# EAGLE design memory_decoder (EAGLE 5.11)
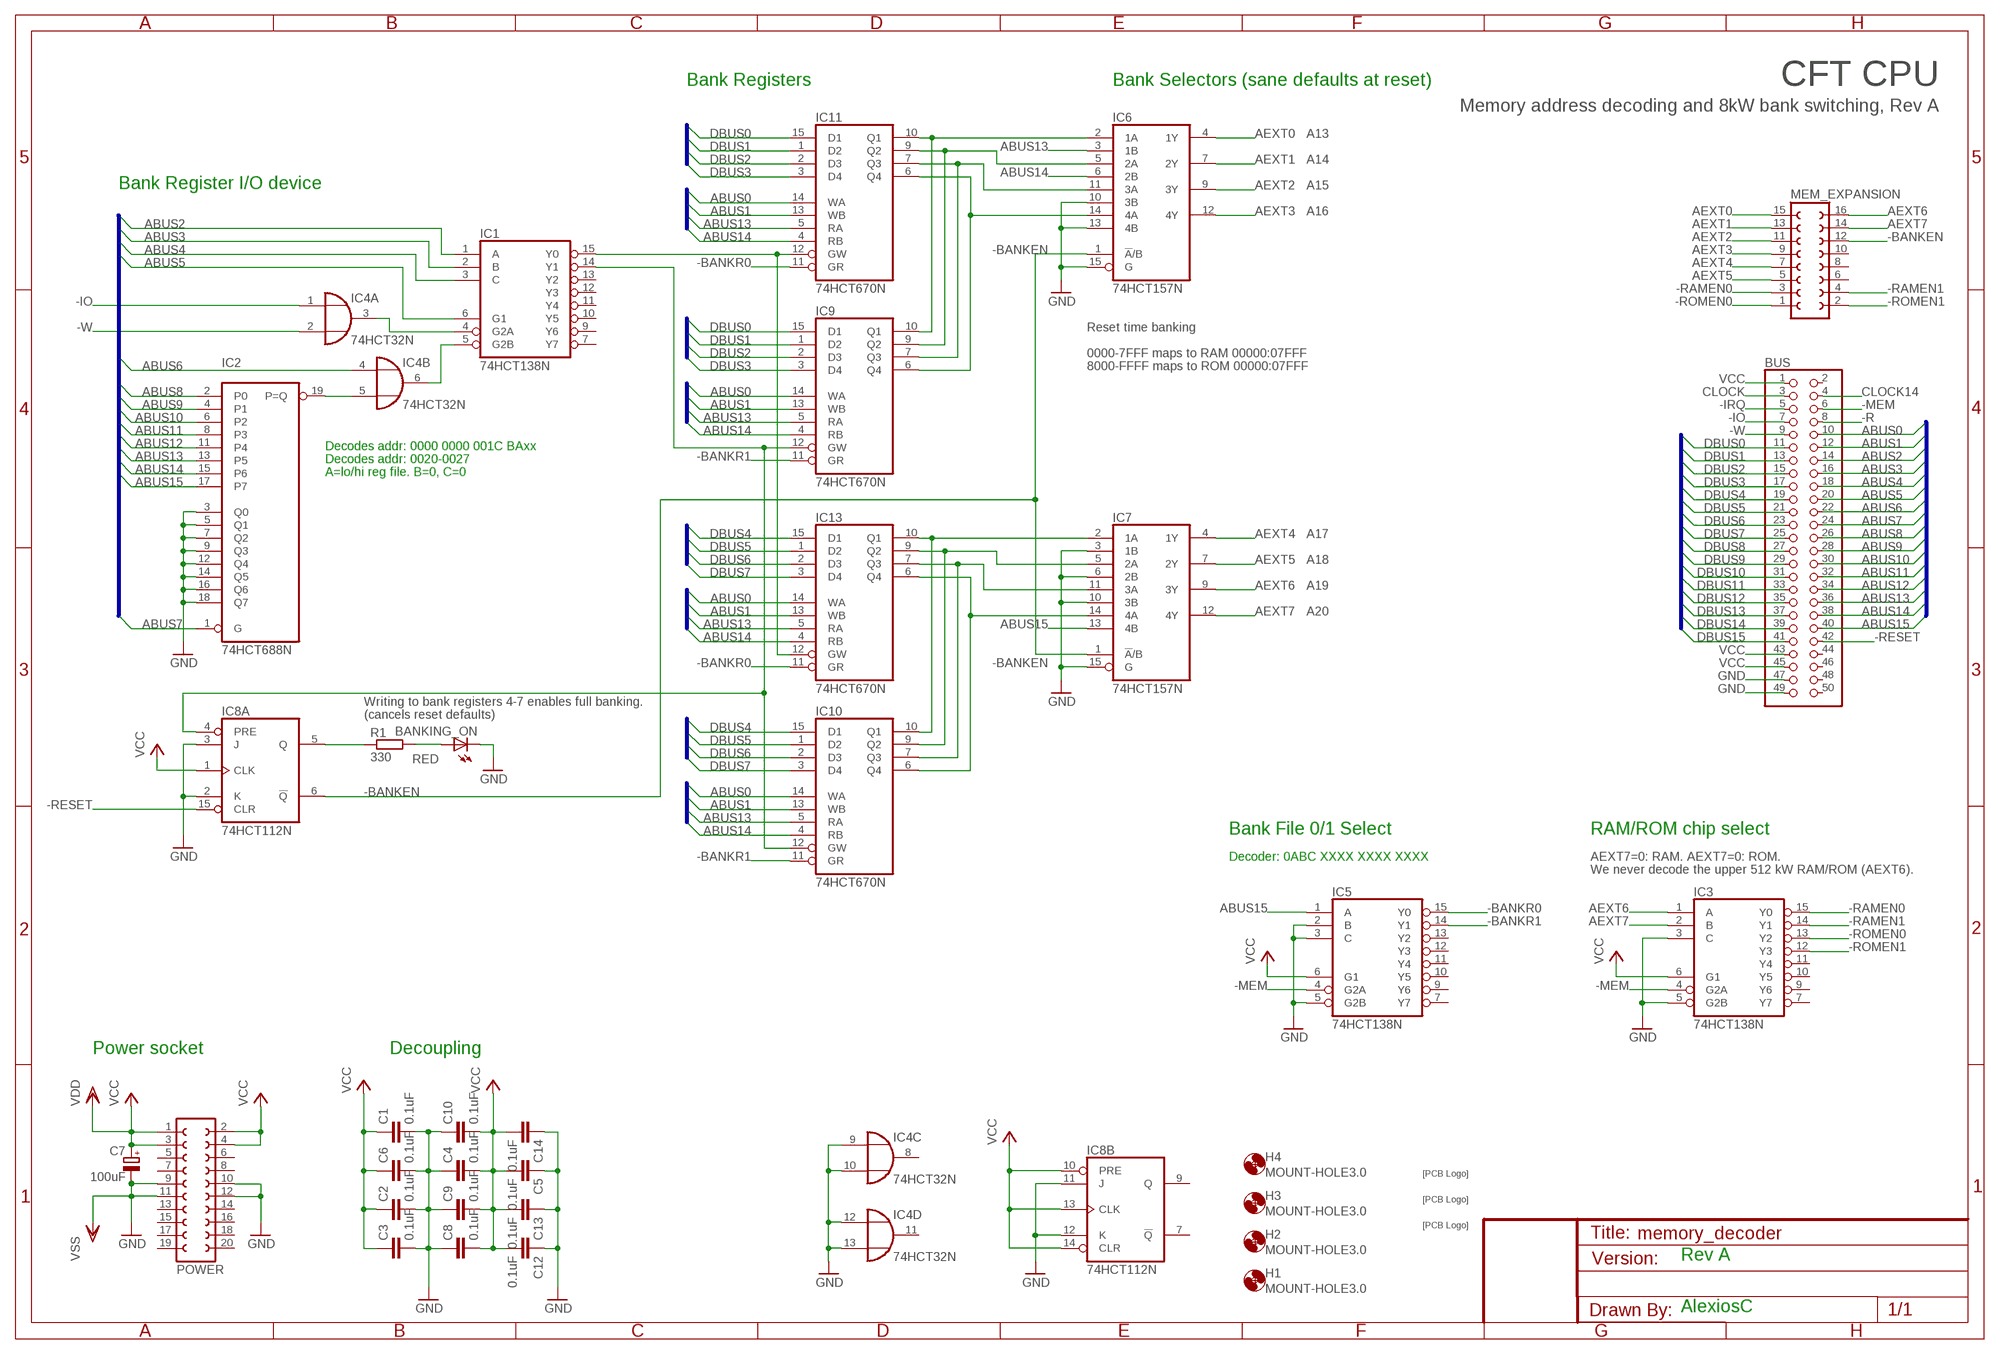
[diagram p0: schematic, sheet 1]

## Parts
BANKING_ON  RED  LEDIRL80A  [IRL80A]
BUS  PINHD-2X25  [2X25]
C1  0.1uF  C-EU025-025X050  [C025-025X050]
C2  0.1uF  C-EU025-025X050  [C025-025X050]
C3  0.1uF  C-EU025-025X050  [C025-025X050]
C4  0.1uF  C-EU025-025X050  [C025-025X050]
C5  0.1uF  C-EU025-025X050  [C025-025X050]
C6  0.1uF  C-EU025-025X050  [C025-025X050]
C7  100uF  CPOL-EUE2.5-6  [E2,5-6]
C8  0.1uF  C-EU025-025X050  [C025-025X050]
C9  0.1uF  C-EU025-025X050  [C025-025X050]
C10  0.1uF  C-EU025-025X050  [C025-025X050]
C12  0.1uF  C-EU025-025X050  [C025-025X050]
C13  0.1uF  C-EU025-025X050  [C025-025X050]
C14  0.1uF  C-EU025-025X050  [C025-025X050]
H1  MOUNT-HOLE3.0  [3,0]
H2  MOUNT-HOLE3.0  [3,0]
H3  MOUNT-HOLE3.0  [3,0]
H4  MOUNT-HOLE3.0  [3,0]
IC1  74HCT138N  [DIL16]
IC2  74HCT688N  [DIL20]
IC3  74HCT138N  [DIL16]
IC4  74HCT32N  [DIL14]
IC5  74HCT138N  [DIL16]
IC6  74HCT157N  [DIL16]
IC7  74HCT157N  [DIL16]
IC8  74HCT112N  [DIL16]
IC9  74HCT670N  [DIL16]
IC10  74HCT670N  [DIL16]
IC11  74HCT670N  [DIL16]
IC13  74HCT670N  [DIL16]
MEM_EXPANSION  FE08-2  [FE08-2]
POWER  FE10-2  [FE10-2]
R1  330  R-EU_0204/7  [0204/7]
U$1  SIGNATUREPLANE  [SIGNATURE_PLANE]
U$2  SIGNATUREPLANE  [SIGNATURE_PLANE]
U$3  SIGNATURESILK  [SIGNATURE]

## Nets
-BANKEN: IC6.1(!A!/B) IC7.1(!A!/B) IC8.6(A:!Q) MEM_EXPANSION.12
-BANKR0: IC5.15(Y0) IC11.11(GR) IC13.11(GR)
-BANKR1: IC5.14(Y1) IC9.11(GR) IC10.11(GR)
-IO: BUS.7 IC4.1(A:I0)
-IRQ: BUS.5
-MEM: BUS.6 IC3.4(G2A) IC5.4(G2A)
-R: BUS.8
-RAMEN0: IC3.15(Y0) MEM_EXPANSION.3
-RAMEN1: IC3.14(Y1) MEM_EXPANSION.4
-RESET: BUS.42 IC8.15(A:CLR)
-ROMEN0: IC3.13(Y2) MEM_EXPANSION.1
-ROMEN1: IC3.12(Y3) MEM_EXPANSION.2
-W: BUS.9 IC4.2(A:I1)
ABUS0: BUS.10 IC9.14(WA) IC10.14(WA) IC11.14(WA) IC13.14(WA)
ABUS1: BUS.12 IC9.13(WB) IC10.13(WB) IC11.13(WB) IC13.13(WB)
ABUS2: BUS.14 IC1.1(A)
ABUS3: BUS.16 IC1.2(B)
ABUS4: BUS.18 IC1.3(C)
ABUS5: BUS.20 IC1.6(G1)
ABUS6: BUS.22 IC4.4(B:I0)
ABUS7: BUS.24 IC2.1(G)
ABUS8: BUS.26 IC2.2(P0)
ABUS9: BUS.28 IC2.4(P1)
ABUS10: BUS.30 IC2.6(P2)
ABUS11: BUS.32 IC2.8(P3)
ABUS12: BUS.34 IC2.11(P4)
ABUS13: BUS.36 IC2.13(P5) IC6.3(1B) IC9.5(RA) IC10.5(RA) IC11.5(RA) IC13.5(RA)
ABUS14: BUS.38 IC2.15(P6) IC6.6(2B) IC9.4(RB) IC10.4(RB) IC11.4(RB) IC13.4(RB)
ABUS15: BUS.40 IC2.17(P7) IC5.1(A) IC7.13(4B)
AEXT0: IC6.4(1Y) MEM_EXPANSION.15
AEXT1: IC6.7(2Y) MEM_EXPANSION.13
AEXT2: IC6.9(3Y) MEM_EXPANSION.11
AEXT3: IC6.12(4Y) MEM_EXPANSION.9
AEXT4: IC7.4(1Y) MEM_EXPANSION.7
AEXT5: IC7.7(2Y) MEM_EXPANSION.5
AEXT6: IC3.1(A) IC7.9(3Y) MEM_EXPANSION.16
AEXT7: IC3.2(B) IC7.12(4Y) MEM_EXPANSION.14
CLOCK: BUS.3
CLOCK14: BUS.4
DBUS0: BUS.11 IC9.15(D1) IC11.15(D1)
DBUS1: BUS.13 IC9.1(D2) IC11.1(D2)
DBUS2: BUS.15 IC9.2(D3) IC11.2(D3)
DBUS3: BUS.17 IC9.3(D4) IC11.3(D4)
DBUS4: BUS.19 IC10.15(D1) IC13.15(D1)
DBUS5: BUS.21 IC10.1(D2) IC13.1(D2)
DBUS6: BUS.23 IC10.2(D3) IC13.2(D3)
DBUS7: BUS.25 IC10.3(D4) IC13.3(D4)
DBUS8: BUS.27
DBUS9: BUS.29
DBUS10: BUS.31
DBUS11: BUS.33
DBUS12: BUS.35
DBUS13: BUS.37
DBUS14: BUS.39
DBUS15: BUS.41
GND: BANKING_ON.K(C) BUS.47 BUS.49 C1.2 C2.2 C3.2 C4.1 C5.1 C6.2 C7.- C8.1 C9.1 C10.1 C12.1 C13.1 C14.1 IC2.3(Q0) IC2.5(Q1) IC2.7(Q2) IC2.9(Q3) IC2.12(Q4) IC2.14(Q5) IC2.16(Q6) IC2.18(Q7) IC3.3(C) IC3.5(G2B) IC4.9(C:I0) IC4.10(C:I1) IC4.12(D:I0) IC4.13(D:I1) IC5.2(B) IC5.3(C) IC5.5(G2B) IC6.10(3B) IC6.13(4B) IC6.15(G) IC7.3(1B) IC7.6(2B) IC7.10(3B) IC7.15(G) IC8.2(A:K) IC8.3(A:J) IC8.11(B:J) IC8.12(B:K) POWER.9 POWER.10 POWER.11 POWER.12 ; supply symbol labelled VSS
N$1: IC6.5(2A) IC9.9(Q2) IC11.9(Q2)
N$2: IC7.2(1A) IC10.10(Q1) IC13.10(Q1)
N$3: IC7.5(2A) IC10.9(Q2) IC13.9(Q2)
N$4: IC7.11(3A) IC10.7(Q3) IC13.7(Q3)
N$5: IC1.4(G2A) IC4.3(A:O)
N$6: IC2.19(P=Q) IC4.5(B:I1)
N$7: IC1.15(Y0) IC11.12(GW) IC13.12(GW)
N$8: IC1.14(Y1) IC8.4(A:PRE) IC9.12(GW) IC10.12(GW)
N$9: IC6.2(1A) IC9.10(Q1) IC11.10(Q1)
N$10: IC6.11(3A) IC9.7(Q3) IC11.7(Q3)
N$11: IC6.14(4A) IC9.6(Q4) IC11.6(Q4)
N$12: IC1.5(G2B) IC4.6(B:O)
N$13: IC7.14(4A) IC10.6(Q4) IC13.6(Q4)
N$14: IC8.5(A:Q) R1.1
N$15: BANKING_ON.A R1.2
VCC: BUS.1 BUS.43 BUS.45 C1.1 C2.1 C3.1 C4.2 C5.2 C6.1 C7.+ C8.2 C9.2 C10.2 C12.2 C13.2 C14.2 IC3.6(G1) IC5.6(G1) IC8.1(A:CLK) IC8.10(B:PRE) IC8.13(B:CLK) IC8.14(B:CLR) POWER.1 POWER.2 POWER.3 POWER.4 ; supply symbol labelled VDD
Unconnected: BUS.2 BUS.44 BUS.46 BUS.48 BUS.50 IC1.7(Y7) IC1.9(Y6) IC1.10(Y5) IC1.11(Y4) IC1.12(Y3) IC1.13(Y2) IC3.7(Y7) IC3.9(Y6) IC3.10(Y5) IC3.11(Y4) IC4.8(C:O) IC4.11(D:O) IC5.7(Y7) IC5.9(Y6) IC5.10(Y5) IC5.11(Y4) IC5.12(Y3) IC5.13(Y2) IC8.7(B:!Q) IC8.9(B:Q) MEM_EXPANSION.6 MEM_EXPANSION.8 MEM_EXPANSION.10 POWER.5 POWER.6 POWER.7 POWER.8 POWER.13 POWER.14 POWER.15 POWER.16 POWER.17 POWER.18 POWER.19 POWER.20

## Buses
ABUS[0..15]
DBUS[0..15]

## Notes on the sheet
- Bank Registers | Bank Selectors (sane defaults at reset) | CFT CPU
- Memory address decoding and 8kW bank switching, Rev A
- A13
- A14
- Bank Register I/O device | A15
- A16
- Reset time banking
- 0000-7FFF maps to RAM 00000:07FFF
- 8000-FFFF maps to ROM 00000:07FFF
- Decodes addr: 0000 0000 001C BAxx
- Decodes addr: 0020-0027
- A=lo/hi reg file. B=0, C=0
- A17
- A18
- A19
- A20
- Writing to bank registers 4-7 enables full banking.
- (cancels reset defaults)
- Bank File 0/1 Select | RAM/ROM chip select
- Decoder: 0ABC XXXX XXXX XXXX | AEXT7=0: RAM. AEXT7=0: ROM.
- We never decode the upper 512 kW RAM/ROM (AEXT6).
- Power socket | Decoupling
- Rev A
- AlexiosC

## Power pins joined to a net without a drawn wire
GND: IC1.8(GND) IC2.10(GND) IC3.8(GND) IC4.7(P:GND) IC5.8(GND) IC6.8(GND) IC7.8(GND) IC8.8(P:GND) IC9.8(GND) IC10.8(GND) IC11.8(GND) IC13.8(GND)
VCC: IC1.16(VCC) IC2.20(VCC) IC3.16(VCC) IC4.14(P:VCC) IC5.16(VCC) IC6.16(VCC) IC7.16(VCC) IC8.16(P:VCC) IC9.16(VCC) IC10.16(VCC) IC11.16(VCC) IC13.16(VCC)

## Library data of the parts
BANKING_ON = led:LED: LED OSRAM: - CHIPLED LG R971, LG N971, LY N971, LG Q971, LY Q971, LO R971, LY R971 LH N974, LH R974 LS Q976, LO Q976, LY Q976 LO Q996 - Hyper CHIPLED LW Q18S LB Q993, LB Q99A, LB R99A - SideLED LS A670, LO A670, LY A670, LG A670, LP A670 LB A673, LV A673, LT A673, LW A673 LH A674 LY A675 LS A676, LA A676, LO A676, LY A676, LW A676 LS A679, LY A679, LG A679 - Hyper Micro SIDELED® LS Y876, LA Y876, LO Y876, LY Y876 LT Y87S - SmartLED LW L88C, LW L88S LB L89C, LB L89S, LG L890 LS L89K, LO L89K, LY L89K LS L896, LA L896, LO L896, LY L896 - TOPLED LS T670, LO T670, LY T670, LG T670, LP T670 LSG T670, LSP T670, LSY T670, LOP T670, LYG T670 LG T671, LOG T671, LSG T671 LB T673, LV T673, LT T673, LW T673 LH T674 LS T676, LA T676, LO T676, LY T676, LB T676, LH T676, LSB T676, LW T676 LB T67C, LV T67C, LT T67C, LS T67K, LO T67K, LY T67K, LW E67C LS E67B, LA E67B, LO E67B, LY E67B, LB E67C, LV E67C, LT E67C LW T67C LS T679, LY T679, LG T679 LS T770, LO T770, LY T770, LG T770, LP T770 LB T773, LV T773, LT T773, LW T773 LH T774 LS E675, LA E675, LY E675, LS T675 LS T776, LA T776, LO T776, LY T776, LB T776 LHGB T686 LT T68C, LB T68C - Hyper Mini TOPLED® LB M676 - Mini TOPLED Santana® LG M470 LS M47K, LO M47K, LY M47K Source: http://www.osram.convergy.de LUXEON: - LUMILED® LXK2-PW12-R00, LXK2-PW12-S00, LXK2-PW14-U00, LXK2-PW14-V00 LXK2-PM12-R00, LXK2-PM12-S00, LXK2-PM14-U00 LXK2-PE12-Q00, LXK2-PE12-R00, LXK2-PE12-S00, LXK2-PE14-T00, LXK2-PE14-U00 LXK2-PB12-K00, LXK2-PB12-L00, LXK2-PB12-M00, LXK2-PB14-N00, LXK2-PB14-P00, LXK2-PB14-Q00 LXK2-PR12-L00, LXK2-PR12-M00, LXK2-PR14-Q00, LXK2-PR14-R00 LXK2-PD12-Q00, LXK2-PD12-R00, LXK2-PD12-S00 LXK2-PH12-R00, LXK2-PH12-S00 LXK2-PL12-P00, LXK2-PL12-Q00, LXK2-PL12-R00 Source: www.luxeon.com KINGBRIGHT: KA-3528ASYC Source: www.kingbright.com
BUS = pinhead:PINHD-2X25: PIN HEADER
C1-C6 C8-C10 C12-C14 = rcl:C-EU: CAPACITOR, European symbol
C7 = rcl:CPOL-EU: POLARIZED CAPACITOR, European symbol
H1-H4 = holes:MOUNT-HOLE: MOUNTING HOLE with drill center marker
IC1 IC3 IC5 = 74xx-eu:74*138: 3-line to 8-line DECODER/DEMULTIPLEXER
IC2 = 74xx-eu:74*688: 8-bit MAGNITUDE/IDENTITY COMPARATOR, totem pole
IC4 = 74xx-eu:74*32: Quad 2-input OR gate
IC6 IC7 = 74xx-eu:74*157: Quadruple 2-line to 1-line data SELECTOR/MULTIPLEXER
IC8 = 74xx-eu:74*112: Dual J-K negative edge triggered FLIP FLOP, preset and clear
IC9-IC11 IC13 = 74xx-eu:74*670: 4 by 4 REGISTER FILES, 3-state
MEM_EXPANSION = con-lsta:FE08-2: FEMALE HEADER; OC_FARNELL: unknown; OC_NEWARK: unknown
POWER = con-lsta:FE10-2: FEMALE HEADER; OC_FARNELL: unknown; OC_NEWARK: unknown
R1 = resistor:R-EU_: RESISTOR, European symbol
U$1-U$3 = alexios:SIGNATURE: Soup signature

## Net classes
0 default: width 0.406 mm, clearance 0.305 mm
1 Decoupling: width 1.27 mm

## Board
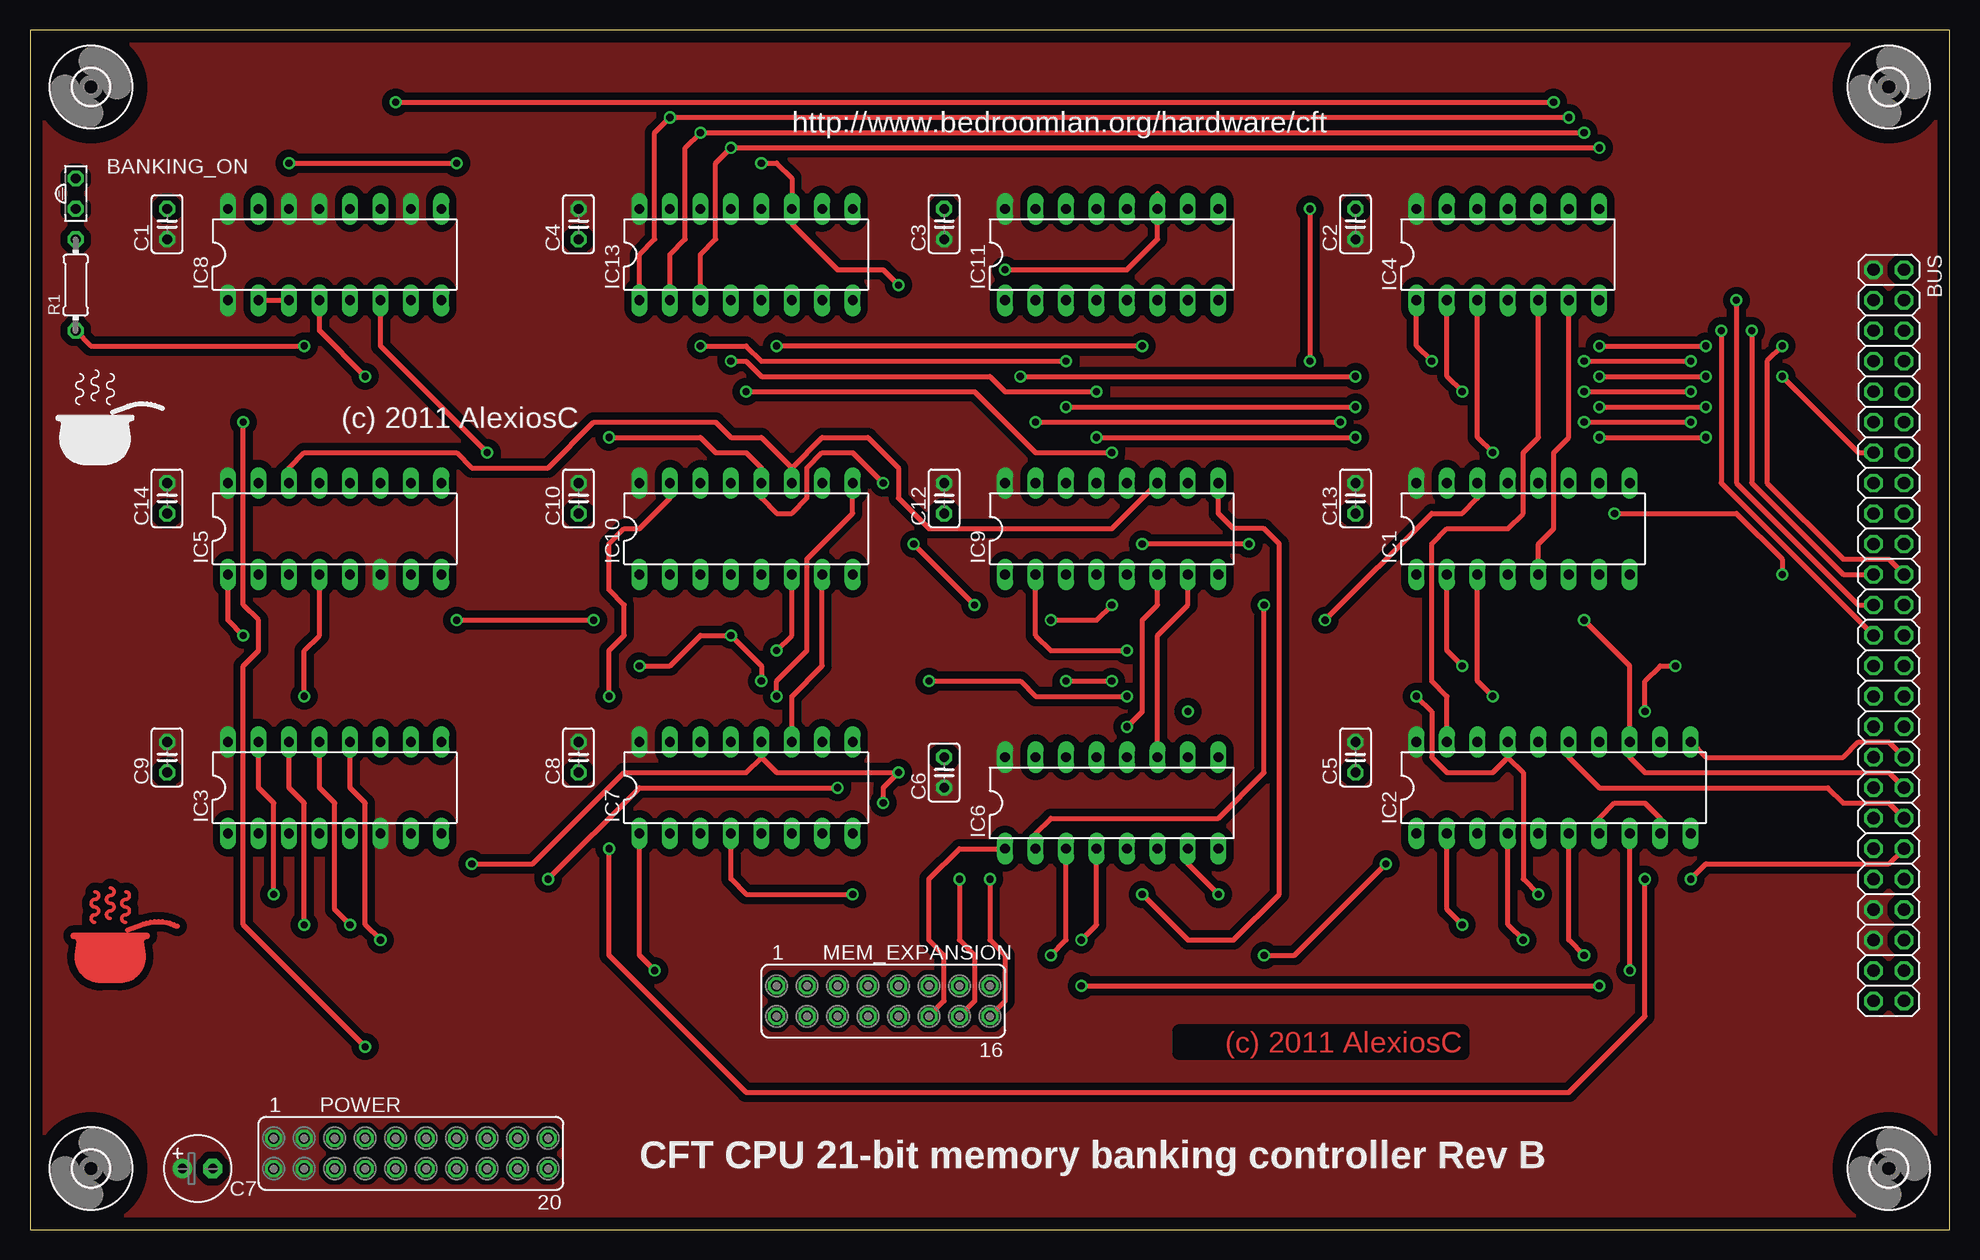
[diagram p1: board, top side]
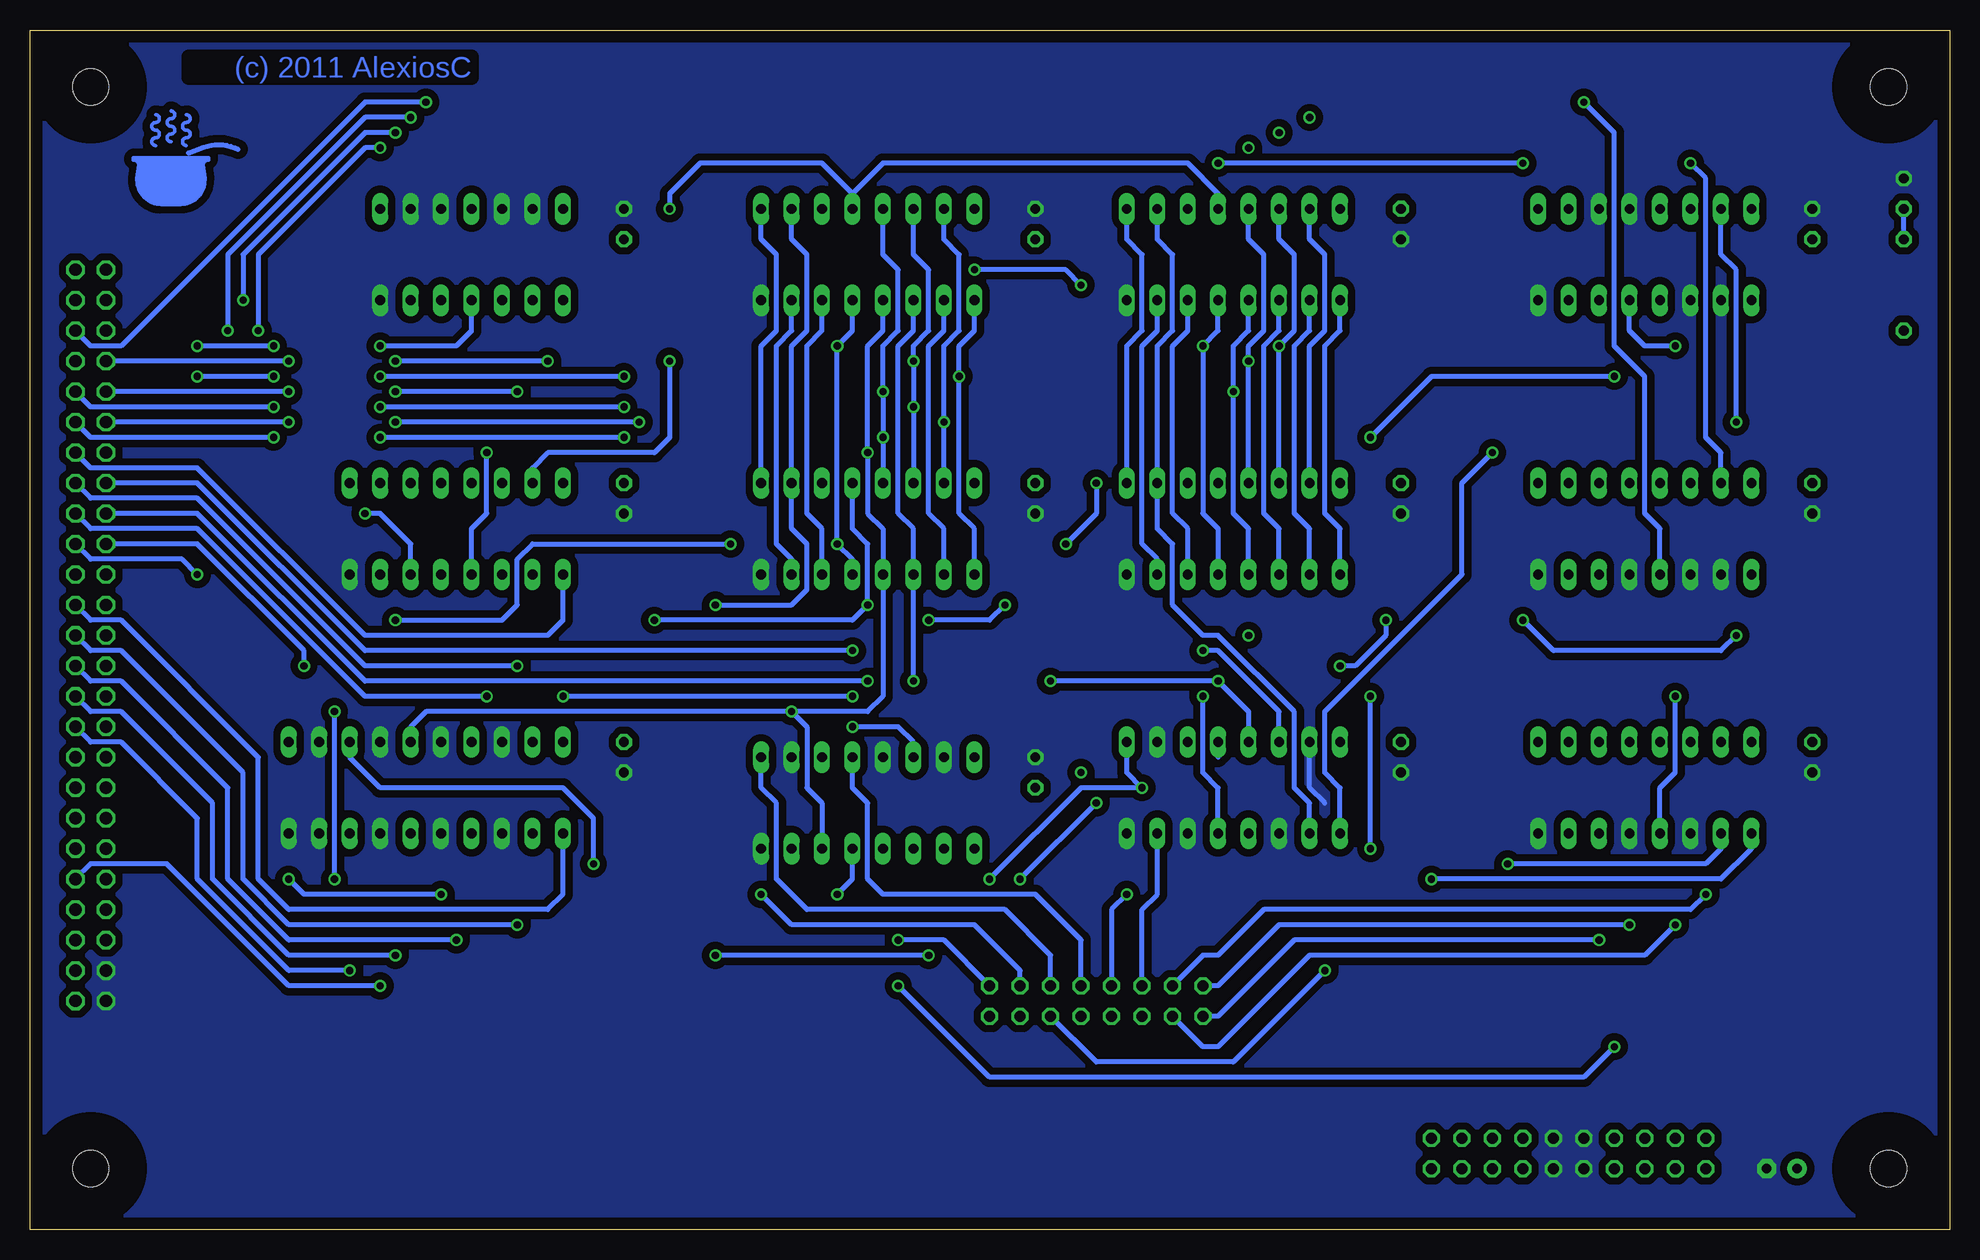
[diagram p2: board, bottom side, seen from below]

Size 160 x 100 mm. Coordinates in mm from the lower left corner, seen from the top.
Outline: 0,0 160,0 160,100 0,100 0,0
Copper layers (1*16): Top 0.035mm / dielectric 1.5mm / Bottom 0.035mm
Design rules "olimex-10mil": minimum track width 10mil, minimum drill 24mil, track to track 10mil, track to pad 10mil, pad to pad 10mil, via to via 10mil, smd to smd 10mil, copper to edge 40mil, drill to drill 10mil, minimum pad ring 10mil, minimum via ring 8mil, stop-mask expansion 0mil, vias tented up to drill 0mil, thermal gap 10mil

### Footprints (pad centres in the part's own frame; a part is rotated, then mirrored left to right if it is on the bottom)
IRL80A = drill 0.813 octagon: A 0,-1.27; K 0,1.27
2X25 = drill 1.016 octagon: 1 -30.48,-1.27; 2 -30.48,1.27; 3 -27.94,-1.27; 4 -27.94,1.27; 5 -25.4,-1.27; 6 -25.4,1.27; 7 -22.86,-1.27; 8 -22.86,1.27; 9 -20.32,-1.27; 10 -20.32,1.27; 11 -17.78,-1.27; 12 -17.78,1.27; 13 -15.24,-1.27; 14 -15.24,1.27; 15 -12.7,-1.27; 16 -12.7,1.27; 17 -10.16,-1.27; 18 -10.16,1.27; 19 -7.62,-1.27; 20 -7.62,1.27; 21 -5.08,-1.27; 22 -5.08,1.27; 23 -2.54,-1.27; 24 -2.54,1.27; 25 0,-1.27; 26 0,1.27; 27 2.54,-1.27; 28 2.54,1.27; 29 5.08,-1.27; 30 5.08,1.27; 31 7.62,-1.27; 32 7.62,1.27; 33 10.16,-1.27; 34 10.16,1.27; 35 12.7,-1.27; 36 12.7,1.27; 37 15.24,-1.27; 38 15.24,1.27; 39 17.78,-1.27; 40 17.78,1.27; 41 20.32,-1.27; 42 20.32,1.27; 43 22.86,-1.27; 44 22.86,1.27; 45 25.4,-1.27; 46 25.4,1.27; 47 27.94,-1.27; 48 27.94,1.27; 49 30.48,-1.27; 50 30.48,1.27
C025-025X050 = drill 0.813 octagon: 1 -1.27,0; 2 1.27,0
E2,5-6 = drill 0.813 pad 1.6 round: + -1.27,0 | drill 0.813 pad 1.6 octagon: - 1.27,0
3,0 = hole 3: 0,0
DIL16 = drill 0.813 long: 1 -8.89,-3.81; 2 -6.35,-3.81; 3 -3.81,-3.81; 4 -1.27,-3.81; 5 1.27,-3.81; 6 3.81,-3.81; 7 6.35,-3.81; 8 8.89,-3.81; 9 8.89,3.81; 10 6.35,3.81; 11 3.81,3.81; 12 1.27,3.81; 13 -1.27,3.81; 14 -3.81,3.81; 15 -6.35,3.81; 16 -8.89,3.81
DIL20 = drill 0.813 long: 1 -11.43,-3.81; 2 -8.89,-3.81; 3 -6.35,-3.81; 4 -3.81,-3.81; 5 -1.27,-3.81; 6 1.27,-3.81; 7 3.81,-3.81; 8 6.35,-3.81; 9 8.89,-3.81; 10 11.43,-3.81; 11 11.43,3.81; 12 8.89,3.81; 13 6.35,3.81; 14 3.81,3.81; 15 1.27,3.81; 16 -1.27,3.81; 17 -3.81,3.81; 18 -6.35,3.81; 19 -8.89,3.81; 20 -11.43,3.81
DIL14 = drill 0.813 long: 1 -7.62,-3.81; 2 -5.08,-3.81; 3 -2.54,-3.81; 4 0,-3.81; 5 2.54,-3.81; 6 5.08,-3.81; 7 7.62,-3.81; 8 7.62,3.81; 9 5.08,3.81; 10 2.54,3.81; 11 0,3.81; 12 -2.54,3.81; 13 -5.08,3.81; 14 -7.62,3.81
FE08-2 = drill 0.914 octagon: 1 -8.89,1.27; 2 -8.89,-1.27; 3 -6.35,1.27; 4 -6.35,-1.27; 5 -3.81,1.27; 6 -3.81,-1.27; 7 -1.27,1.27; 8 -1.27,-1.27; 9 1.27,1.27; 10 1.27,-1.27; 11 3.81,1.27; 12 3.81,-1.27; 13 6.35,1.27; 14 6.35,-1.27; 15 8.89,1.27; 16 8.89,-1.27
FE10-2 = drill 0.914 octagon: 1 -11.43,1.27; 2 -11.43,-1.27; 3 -8.89,1.27; 4 -8.89,-1.27; 5 -6.35,1.27; 6 -6.35,-1.27; 7 -3.81,1.27; 8 -3.81,-1.27; 9 -1.27,1.27; 10 -1.27,-1.27; 11 1.27,1.27; 12 1.27,-1.27; 13 3.81,1.27; 14 3.81,-1.27; 15 6.35,1.27; 16 6.35,-1.27; 17 8.89,1.27; 18 8.89,-1.27; 19 11.43,1.27; 20 11.43,-1.27
0204/7 = drill 0.813 octagon: 1 -3.81,0; 2 3.81,0

### Placement (x,y rotation side)
BANKING_ON  3.81,86.36 0 top
BUS  154.94,49.53 270 top
C1  11.43,83.82 90 top
C2  110.49,83.82 90 top
C3  76.2,83.82 90 top
C4  45.72,83.82 90 top
C5  110.49,39.37 90 top
C6  76.2,38.1 90 top
C7  13.97,5.08 0 top
C8  45.72,39.37 90 top
C9  11.43,39.37 90 top
C10  45.72,60.96 90 top
C12  76.2,60.96 90 top
C13  110.49,60.96 90 top
C14  11.43,60.96 90 top
H1  154.94,95.25 0 top
H2  154.94,5.08 0 top
H3  5.08,5.08 0 top
H4  5.08,95.25 0 top
IC1  124.46,58.42 0 top
IC2  127,36.83 0 top
IC3  25.4,36.83 0 top
IC4  123.19,81.28 0 top
IC5  25.4,58.42 0 top
IC6  90.17,35.56 0 top
IC7  59.69,36.83 0 top
IC8  25.4,81.28 0 top
IC9  90.17,58.42 0 top
IC10  59.69,58.42 0 top
IC11  90.17,81.28 0 top
IC13  59.69,81.28 0 top
MEM_EXPANSION  71.12,19.05 0 top
POWER  31.75,6.35 0 top
R1  3.81,78.74 90 top
U$1  3.81,20.32 0 top
U$2  151.13,85.09 0 bottom
U$3  2.54,63.5 0 top

### Tracks (layer width: path | path; a pad name or v marks a point on that pad's centre or on a via)
-BANKEN  (via drill 0.6)
  Top 0.406: v52.07,21.59 50.8,22.86 IC7.1 | IC6.1 77.47,31.75 74.93,29.21 74.93,24.13 76.2,22.86 76.2,19.05 MEM_EXPANSION.12 | v38.1,64.77 29.21,73.66 IC8.6
  Bottom 0.406: v52.07,21.59 59.69,13.97 71.12,13.97 MEM_EXPANSION.12 | v38.1,64.77 40.64,62.23 40.64,54.61 52.07,43.18 52.07,38.1 50.8,36.83 IC7.1
-BANKR0  (via drill 0.6)
  Top 0.406: 93.98,86.36 IC11.11 93.98,82.55 91.44,80.01 v81.28,80.01 | v21.59,88.9 v35.56,88.9 | v60.96,88.9 62.23,88.9 63.5,87.63 IC13.11 63.5,83.82 67.31,80.01 71.12,80.01 v72.39,78.74
  Bottom 0.406: v35.56,88.9 v60.96,88.9 | v72.39,78.74 73.66,80.01 v81.28,80.01 | IC5.15 19.05,64.77 20.32,66.04 20.32,87.63 v21.59,88.9
-BANKR1
  Top 0.406: IC5.14 21.59,63.5 22.86,64.77 35.56,64.77 36.83,63.5 43.18,63.5 46.99,67.31 57.15,67.31 58.42,66.04 60.96,66.04 63.5,63.5 | 63.5,63.5 IC10.11 | IC9.11 90.17,58.42 74.93,58.42 72.39,60.96 72.39,63.5 69.85,66.04 66.04,66.04 63.5,63.5
-IO  (via drill 0.6)
  Top 0.406: IC4.1 115.57,73.66 v116.84,72.39 | v129.54,72.39 v138.43,72.39
  Bottom 0.406: v116.84,72.39 v129.54,72.39 | v138.43,72.39 BUS.7
-MEM  (via drill 0.6)
  Top 0.406: v22.86,44.45 22.86,48.26 24.13,49.53 IC5.4 | v30.48,93.98 v127,93.98
  Bottom 0.406: BUS.6 154.94,73.66 152.4,73.66 132.08,93.98 v127,93.98 | IC3.4 24.13,36.83 22.86,38.1 v22.86,44.45 | IC5.4 24.13,58.42 25.4,59.69 25.4,71.12 27.94,73.66 27.94,91.44 v30.48,93.98
-RAMEN0  (via drill 0.6)
  Top 0.406: IC3.15 19.05,36.83 20.32,35.56 v20.32,27.94
  Bottom 0.406: MEM_EXPANSION.3 62.23,22.86 60.96,22.86 57.15,26.67 21.59,26.67 v20.32,27.94
-RAMEN1  (via drill 0.6)
  Top 0.406: IC3.14 21.59,36.83 22.86,35.56 v22.86,25.4
  Bottom 0.406: v22.86,25.4 25.4,22.86 53.34,22.86 60.96,15.24 62.23,15.24 MEM_EXPANSION.4
-RESET  (via drill 0.6)
  Top 0.406: v87.63,20.32 v130.81,20.32 | v17.78,67.31 17.78,52.07 19.05,50.8 19.05,48.26 17.78,46.99 17.78,25.4 v27.94,15.24
  Bottom 0.406: BUS.42 154.94,30.48 148.59,30.48 138.43,20.32 v130.81,20.32 | v87.63,20.32 80.01,12.7 30.48,12.7 v27.94,15.24 | IC8.15 19.05,81.28 17.78,80.01 v17.78,67.31
-ROMEN0  (via drill 0.6)
  Top 0.406: IC3.13 24.13,36.83 25.4,35.56 25.4,26.67 v26.67,25.4
  Bottom 0.406: MEM_EXPANSION.1 60.96,20.32 55.88,25.4 v26.67,25.4
-ROMEN1  (via drill 0.6)
  Top 0.406: IC3.12 26.67,36.83 27.94,35.56 27.94,25.4 v29.21,24.13
  Bottom 0.406: MEM_EXPANSION.2 60.96,17.78 54.61,24.13 v29.21,24.13
-W  (via drill 0.6)
  Top 0.406: IC4.2 118.11,71.12 v119.38,69.85 | v129.54,69.85 v138.43,69.85
  Bottom 0.406: v119.38,69.85 v129.54,69.85 | v138.43,69.85 BUS.9
ABUS0  (via drill 0.6)
  Top 0.406: v86.36,68.58 v110.49,68.58 | v55.88,73.66 59.69,73.66 60.96,72.39 v86.36,72.39 | v130.81,68.58 v139.7,68.58
  Bottom 0.406: IC13.14 55.88,82.55 54.61,81.28 54.61,74.93 v55.88,73.66 IC10.14 | IC11.14 86.36,81.28 85.09,80.01 85.09,74.93 86.36,73.66 v86.36,72.39 v86.36,68.58 IC9.14 | BUS.10 154.94,68.58 v139.7,68.58 | v110.49,68.58 v130.81,68.58
ABUS1  (via drill 0.6)
  Top 0.406: v88.9,66.04 v110.49,66.04 | v58.42,72.39 59.69,72.39 60.96,71.12 80.01,71.12 81.28,69.85 v88.9,69.85 | v130.81,66.04 v139.7,66.04
  Bottom 0.406: IC13.13 58.42,82.55 57.15,81.28 57.15,74.93 58.42,73.66 v58.42,72.39 IC10.13 | IC11.13 88.9,81.28 87.63,80.01 87.63,74.93 88.9,73.66 v88.9,69.85 v88.9,66.04 IC9.13 | BUS.12 154.94,66.04 v139.7,66.04 | v110.49,66.04 v130.81,66.04
ABUS2
  Bottom 0.406: BUS.14 154.94,63.5 146.05,63.5 132.08,49.53 116.84,49.53 115.57,50.8 IC1.1
ABUS3  (via drill 0.6)
  Top 0.406: IC1.2 118.11,48.26 v119.38,46.99
  Bottom 0.406: BUS.16 154.94,60.96 146.05,60.96 132.08,46.99 v119.38,46.99
ABUS4  (via drill 0.6)
  Top 0.406: IC1.3 120.65,45.72 v121.92,44.45
  Bottom 0.406: BUS.18 154.94,58.42 146.05,58.42 132.08,44.45 v121.92,44.45
ABUS5  (via drill 0.6)
  Top 0.406: v132.08,59.69 142.24,59.69 146.05,55.88 v146.05,54.61
  Bottom 0.406: IC1.6 128.27,57.15 130.81,59.69 v132.08,59.69 | v146.05,54.61 147.32,55.88 154.94,55.88 BUS.20
ABUS6  (via drill 0.6)
  Top 0.406: v146.05,73.66 144.78,72.39 144.78,62.23 151.13,55.88 154.94,55.88 BUS.22 | v130.81,73.66 v139.7,73.66
  Bottom 0.406: IC4.4 123.19,74.93 124.46,73.66 v130.81,73.66 | v139.7,73.66 v146.05,73.66
ABUS7
  Bottom 0.406: BUS.24 154.94,50.8 152.4,50.8 140.97,39.37 140.97,29.21 138.43,26.67 116.84,26.67 115.57,27.94 IC2.1
ABUS8  (via drill 0.6)
  Top 0.406: v119.38,25.4 118.11,26.67 IC2.2
  Bottom 0.406: BUS.26 154.94,48.26 152.4,48.26 142.24,38.1 142.24,29.21 138.43,25.4 v119.38,25.4
ABUS9  (via drill 0.6)
  Top 0.406: v124.46,24.13 123.19,25.4 IC2.4
  Bottom 0.406: BUS.28 154.94,45.72 152.4,45.72 143.51,36.83 143.51,29.21 138.43,24.13 v124.46,24.13
ABUS10  (via drill 0.6)
  Top 0.406: v129.54,22.86 128.27,24.13 IC2.6
  Bottom 0.406: BUS.30 154.94,43.18 152.4,43.18 144.78,35.56 144.78,29.21 138.43,22.86 v129.54,22.86
ABUS11  (via drill 0.6)
  Top 0.406: v133.35,21.59 IC2.8
  Bottom 0.406: BUS.32 154.94,40.64 152.4,40.64 146.05,34.29 146.05,29.21 138.43,21.59 v133.35,21.59
ABUS12
  Top 0.406: BUS.34 154.94,40.64 152.4,40.64 151.13,39.37 139.7,39.37 IC2.11
ABUS13  (via drill 0.6)
  Top 0.406: v92.71,73.66 v62.23,73.66 | BUS.36 154.94,38.1 134.62,38.1 133.35,39.37 IC2.13 133.35,46.99 v129.54,50.8 | v101.6,57.15 v92.71,57.15 | IC6.3 86.36,24.13 v85.09,22.86 | v102.87,22.86 105.41,22.86 v113.03,30.48
  Bottom 0.406: IC13.5 60.96,74.93 v62.23,73.66 62.23,59.69 60.96,58.42 IC10.5 | IC11.5 91.44,74.93 v92.71,73.66 v92.71,57.15 91.44,55.88 IC9.5 | v129.54,50.8 120.65,50.8 119.38,52.07 119.38,55.88 118.11,57.15 v101.6,57.15 | v113.03,30.48 113.03,34.29 115.57,36.83 130.81,36.83 133.35,39.37 IC2.13 | v85.09,22.86 v102.87,22.86
ABUS14  (via drill 0.6)
  Top 0.406: v59.69,69.85 78.74,69.85 83.82,64.77 v90.17,64.77 | BUS.38 154.94,35.56 151.13,35.56 149.86,36.83 130.81,36.83 128.27,39.37 IC2.15
  Bottom 0.406: IC13.4 58.42,74.93 59.69,73.66 v59.69,69.85 59.69,59.69 58.42,58.42 IC10.4 | IC11.4 88.9,74.93 90.17,73.66 v90.17,64.77 90.17,59.69 88.9,58.42 IC9.4 88.9,44.45 90.17,43.18 v96.52,43.18 | v96.52,43.18 127,43.18 128.27,41.91 IC2.15 | IC6.6 93.98,35.56 95.25,36.83 95.25,41.91 v96.52,43.18
ABUS15  (via drill 0.6)
  Top 0.406: 123.19,39.37 IC2.17 | 123.19,39.37 124.46,38.1 124.46,29.21 v125.73,27.94 | v138.43,29.21 139.7,30.48 154.94,30.48 BUS.40 | v74.93,45.72 82.55,45.72 83.82,44.45 v91.44,44.45 | v115.57,44.45 116.84,43.18 116.84,39.37 118.11,38.1 121.92,38.1 123.19,39.37 | v60.96,45.72 60.96,46.99 v58.42,49.53 55.88,49.53 53.34,46.99 v50.8,46.99 | v35.56,50.8 v46.99,50.8 | v17.78,49.53 16.51,50.8 IC5.1
  Bottom 0.406: v125.73,27.94 137.16,27.94 v138.43,29.21 | IC7.13 58.42,43.18 v60.96,45.72 v74.93,45.72 | v91.44,44.45 v115.57,44.45 | v46.99,50.8 46.99,49.53 49.53,46.99 v50.8,46.99 | v17.78,49.53 19.05,48.26 33.02,48.26 v35.56,50.8
AEXT0  (via drill 0.6)
  Top 0.406: v87.63,24.13 88.9,25.4 IC6.4
  Bottom 0.406: MEM_EXPANSION.15 83.82,24.13 v87.63,24.13
AEXT1  (via drill 0.6)
  Top 0.406: v99.06,27.94 96.52,30.48 IC6.7
  Bottom 0.406: MEM_EXPANSION.13 77.47,21.59 81.28,25.4 96.52,25.4 v99.06,27.94
AEXT2
  Bottom 0.406: MEM_EXPANSION.11 74.93,22.86 78.74,26.67 95.25,26.67 97.79,29.21 97.79,35.56 99.06,36.83 IC6.9
AEXT3
  Bottom 0.406: MEM_EXPANSION.9 72.39,24.13 76.2,27.94 88.9,27.94 90.17,29.21 90.17,35.56 91.44,36.83 IC6.12
AEXT4  (via drill 0.6)
  Top 0.406: v68.58,27.94 59.69,27.94 58.42,29.21 IC7.4
  Bottom 0.406: MEM_EXPANSION.7 69.85,26.67 v68.58,27.94
AEXT5
  Bottom 0.406: IC7.7 66.04,27.94 67.31,26.67 MEM_EXPANSION.5
AEXT6  (via drill 0.6)
  Top 0.406: v80.01,29.21 80.01,24.13 81.28,22.86 81.28,19.05 MEM_EXPANSION.16 | v43.18,29.21 50.8,36.83 v67.31,36.83
  Bottom 0.406: IC3.1 16.51,31.75 19.05,29.21 v43.18,29.21 | v80.01,29.21 72.39,36.83 v67.31,36.83 68.58,38.1 IC7.9
AEXT7  (via drill 0.6)
  Top 0.406: MEM_EXPANSION.14 78.74,19.05 78.74,22.86 77.47,24.13 v77.47,29.21 | v71.12,35.56 71.12,36.83 v72.39,38.1 62.23,38.1 60.96,39.37 | v36.83,30.48 41.91,30.48 49.53,38.1 59.69,38.1 60.96,39.37 | 60.96,39.37 IC7.12
  Bottom 0.406: IC3.2 19.05,31.75 20.32,30.48 v36.83,30.48 | IC7.12 60.96,39.37 | v71.12,35.56 v77.47,29.21
DBUS0  (via drill 0.6)
  Top 0.406: v83.82,67.31 v109.22,67.31 | v129.54,67.31 v138.43,67.31
  Bottom 0.406: IC11.15 83.82,82.55 82.55,81.28 82.55,74.93 83.82,73.66 v83.82,67.31 IC9.15 | v138.43,67.31 BUS.11 | v109.22,67.31 v129.54,67.31
DBUS1  (via drill 0.6)
  Top 0.406: BUS.13 152.4,64.77 v146.05,71.12 | v82.55,71.12 v110.49,71.12 | v130.81,71.12 v139.7,71.12
  Bottom 0.406: IC11.1 81.28,74.93 82.55,73.66 v82.55,71.12 82.55,59.69 81.28,58.42 IC9.1 | v110.49,71.12 v130.81,71.12 | v139.7,71.12 v146.05,71.12
DBUS2  (via drill 0.6)
  Top 0.406: v91.44,48.26 85.09,48.26 83.82,49.53 IC9.2
  Bottom 0.406: IC11.2 83.82,74.93 85.09,73.66 85.09,59.69 83.82,58.42 IC9.2 | BUS.15 146.05,62.23 132.08,48.26 v91.44,48.26
DBUS3  (via drill 0.6)
  Top 0.406: v86.36,45.72 v90.17,45.72
  Bottom 0.406: IC11.3 86.36,74.93 87.63,73.66 87.63,59.69 86.36,58.42 IC9.3 v86.36,45.72 | BUS.17 146.05,59.69 132.08,45.72 v90.17,45.72
DBUS4  (via drill 0.6)
  Top 0.406: v134.62,29.21 134.62,17.78 128.27,11.43 59.69,11.43 48.26,22.86 v48.26,31.75 | IC10.15 53.34,60.96 50.8,58.42 49.53,58.42 48.26,57.15 48.26,53.34 49.53,52.07 49.53,49.53 48.26,48.26 v48.26,44.45 | v134.62,43.18 134.62,45.72 135.89,46.99 v137.16,46.99
  Bottom 0.406: IC13.15 53.34,82.55 52.07,81.28 52.07,74.93 53.34,73.66 IC10.15 | BUS.19 146.05,57.15 137.16,48.26 v137.16,46.99 | v48.26,31.75 v48.26,44.45 | v134.62,29.21 v134.62,43.18
DBUS5  (via drill 0.6)
  Top 0.406: BUS.21 151.13,54.61 143.51,62.23 v143.51,74.93 | IC13.1 50.8,81.28 52.07,82.55 52.07,91.44 v53.34,92.71 v128.27,92.71
  Bottom 0.406: IC13.1 50.8,74.93 52.07,73.66 52.07,59.69 50.8,58.42 IC10.1 | v143.51,74.93 143.51,81.28 132.08,92.71 v128.27,92.71
DBUS6  (via drill 0.6)
  Top 0.406: BUS.23 152.4,52.07 142.24,62.23 v142.24,77.47 | IC13.2 53.34,81.28 54.61,82.55 54.61,90.17 v55.88,91.44 v129.54,91.44
  Bottom 0.406: IC13.2 53.34,74.93 54.61,73.66 54.61,59.69 53.34,58.42 IC10.2 | v142.24,77.47 142.24,81.28 132.08,91.44 v129.54,91.44
DBUS7  (via drill 0.6)
  Top 0.406: BUS.25 140.97,62.23 v140.97,74.93 | IC13.3 55.88,81.28 57.15,82.55 57.15,88.9 v58.42,90.17 v130.81,90.17
  Bottom 0.406: IC13.3 55.88,74.93 57.15,73.66 57.15,59.69 55.88,58.42 IC10.3 | v140.97,74.93 140.97,81.28 132.08,90.17 v130.81,90.17
GND
  Top 0.406: IC2.7 130.81,34.29 132.08,35.56 134.62,35.56 135.89,34.29 IC2.9 | IC8.2 IC8.3
  Bottom 0.406: IC7.15 53.34,36.83 52.07,35.56
  pour Bottom (isolate 0.61, no thermals): 0,100.33 0,0 160.02,0 160.02,100.33
N$1  (via drill 0.6)
  Top 0.406: IC9.9 99.06,59.69 100.33,58.42 102.87,58.42 104.14,57.15 104.14,27.94 100.33,24.13 96.52,24.13 v92.71,27.94
  Bottom 0.406: IC11.9 99.06,82.55 97.79,81.28 97.79,74.93 99.06,73.66 IC9.9 | v92.71,27.94 91.44,29.21 IC6.5
N$2
  Bottom 0.406: IC13.10 66.04,82.55 64.77,81.28 64.77,74.93 66.04,73.66 IC10.10 66.04,58.42 64.77,57.15 64.77,52.07 62.23,49.53 60.96,49.53 54.61,43.18 54.61,36.83 53.34,35.56 IC7.2
N$3  (via drill 0.6)
  Top 0.406: v62.23,44.45 62.23,45.72 64.77,48.26 64.77,55.88 68.58,59.69 IC10.9
  Bottom 0.406: IC13.9 68.58,82.55 67.31,81.28 67.31,74.93 68.58,73.66 IC10.9 | IC7.5 60.96,36.83 62.23,38.1 v62.23,44.45
N$4
  Top 0.406: IC10.7 66.04,46.99 63.5,44.45 IC7.11
  Bottom 0.406: IC13.7 66.04,74.93 67.31,73.66 67.31,57.15 66.04,55.88 IC10.7
N$5  (via drill 0.6)
  Top 0.406: IC4.3 120.65,66.04 v121.92,64.77
  Bottom 0.406: v121.92,64.77 121.92,59.69 123.19,58.42 IC1.4
N$6
  Top 0.406: IC4.5 125.73,66.04 124.46,64.77 124.46,59.69 123.19,58.42 118.11,58.42 116.84,57.15 116.84,45.72 118.11,44.45 IC2.19
N$7  (via drill 0.6)
  Top 0.406: v106.68,85.09 v106.68,72.39
  Bottom 0.406: IC13.12 60.96,86.36 63.5,88.9 88.9,88.9 91.44,86.36 | 91.44,86.36 IC11.12 | IC1.15 118.11,63.5 116.84,64.77 107.95,64.77 106.68,66.04 v106.68,72.39 | 91.44,86.36 93.98,88.9 104.14,88.9 106.68,86.36 v106.68,85.09
N$8  (via drill 0.6)
  Top 0.406: v48.26,66.04 55.88,66.04 57.15,64.77 59.69,64.77 60.96,63.5 IC10.12 60.96,60.96 62.23,59.69 63.5,59.69 64.77,60.96 64.77,63.5 66.04,64.77 68.58,64.77 v71.12,62.23 | v27.94,71.12 24.13,74.93 IC8.4 | IC1.14 120.65,60.96 119.38,59.69 116.84,59.69 v107.95,50.8 | v90.17,52.07 88.9,50.8 v85.09,50.8 | v73.66,57.15 v78.74,52.07
  Bottom 0.406: v27.94,71.12 43.18,71.12 v48.26,66.04 | IC9.12 91.44,58.42 90.17,57.15 v90.17,52.07 91.44,50.8 v107.95,50.8 | v85.09,50.8 80.01,50.8 v78.74,52.07 | v71.12,62.23 71.12,59.69 v73.66,57.15
N$9  (via drill 0.6)
  Top 0.406: IC6.2 83.82,33.02 85.09,34.29 99.06,34.29 102.87,38.1 v102.87,52.07
  Bottom 0.406: IC11.10 96.52,82.55 95.25,81.28 95.25,74.93 96.52,73.66 IC9.10 96.52,58.42 95.25,57.15 95.25,53.34 96.52,52.07 v102.87,52.07
N$10
  Top 0.406: IC6.11 93.98,49.53 96.52,52.07 IC9.7
  Bottom 0.406: IC11.7 96.52,74.93 97.79,73.66 97.79,57.15 96.52,55.88 IC9.7
N$11  (via drill 0.6)
  Top 0.406: v91.44,41.91 92.71,43.18 92.71,50.8 93.98,52.07 IC9.6
  Bottom 0.406: IC11.6 93.98,74.93 95.25,73.66 95.25,59.69 93.98,58.42 IC9.6 | IC6.14 86.36,40.64 87.63,41.91 v91.44,41.91
N$12
  Top 0.406: IC4.6 128.27,66.04 127,64.77 127,58.42 125.73,57.15 IC1.5
N$13  (via drill 0.6)
  Top 0.406: IC10.6 63.5,49.53 v62.23,48.26
  Bottom 0.406: IC13.6 63.5,74.93 64.77,73.66 64.77,59.69 63.5,58.42 IC10.6 | v62.23,48.26 60.96,48.26 55.88,43.18 IC7.14
N$14  (via drill 0.6)
  Top 0.406: R1.1 5.08,73.66 v22.86,73.66
  Bottom 0.406: IC8.5 26.67,74.93 25.4,73.66 v22.86,73.66
N$15
  Bottom 0.406: R1.2 BANKING_ON.A
VCC
  pour Top (isolate 0.61, no thermals): 0,100.33 0,0 160.02,0 160.02,100.33

### Text on the board
Top: (c) 2011 AlexiosC
Bottom: (c) 2011 AlexiosC
tNames: http://www.bedroomlan.org/hardware/cft | (c) 2011 AlexiosC | CFT CPU 21-bit memory banking controller Rev B